# Altium schematic sheet [04] - POWER.SchDoc
size A3
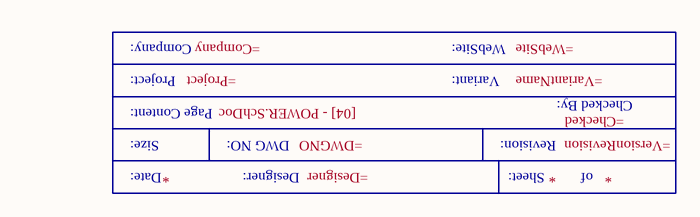
[diagram p0: [04] - POWER.SchDoc]

## Parts
*  Title Block  (value not drawn)  (graphical)

## Notes on the sheet
- (in symbol Title Block) Company:; WebSite:; Project:; Variant:; Checked By:; Page Content:; Size:; DWG NO:; Revision:; Date:; Designer:; Sheet:; of